# EasyEDA Pro project my_supercap_1.eprj, schematic 下板

## Sheets
1 系统总览与接口: Board Name: Board1; Create Date: 2026-09-18; Page Name: 系统总览与接口; Project Name: my_supercap_1; Schematic Name: Schematic1; Update Date: 2026-09-18; Company: 嘉立创EDA; Page Size: A4; Version: V1.0
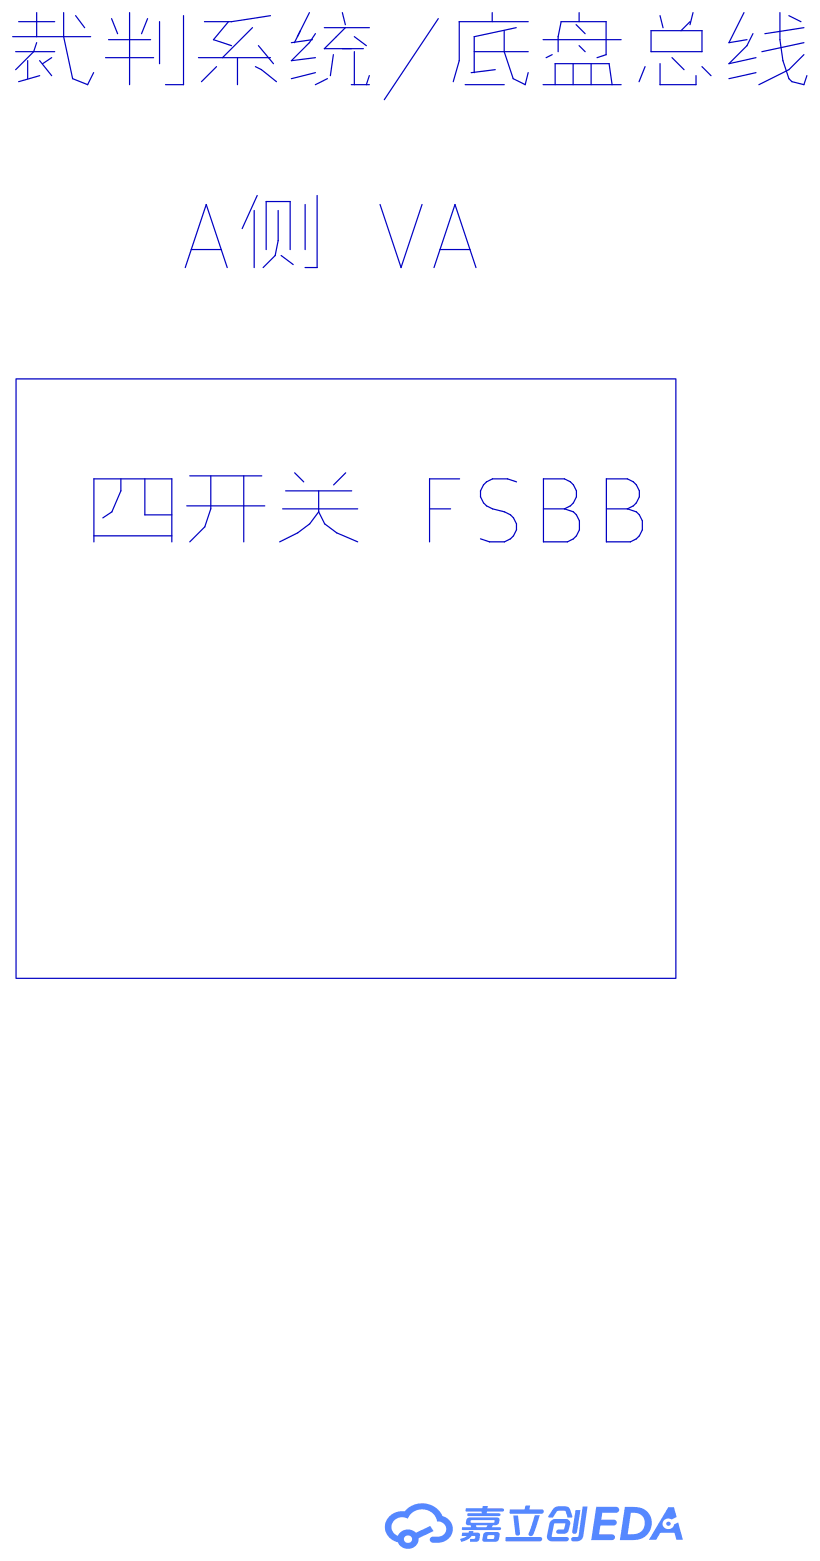
[diagram p0: 系统总览与接口]
2 功率板_四开关主功率回路: Board Name: 下板; Page Name: 功率板_四开关主功率回路; Schematic Name: 下板; Update Date: 2026-09-19
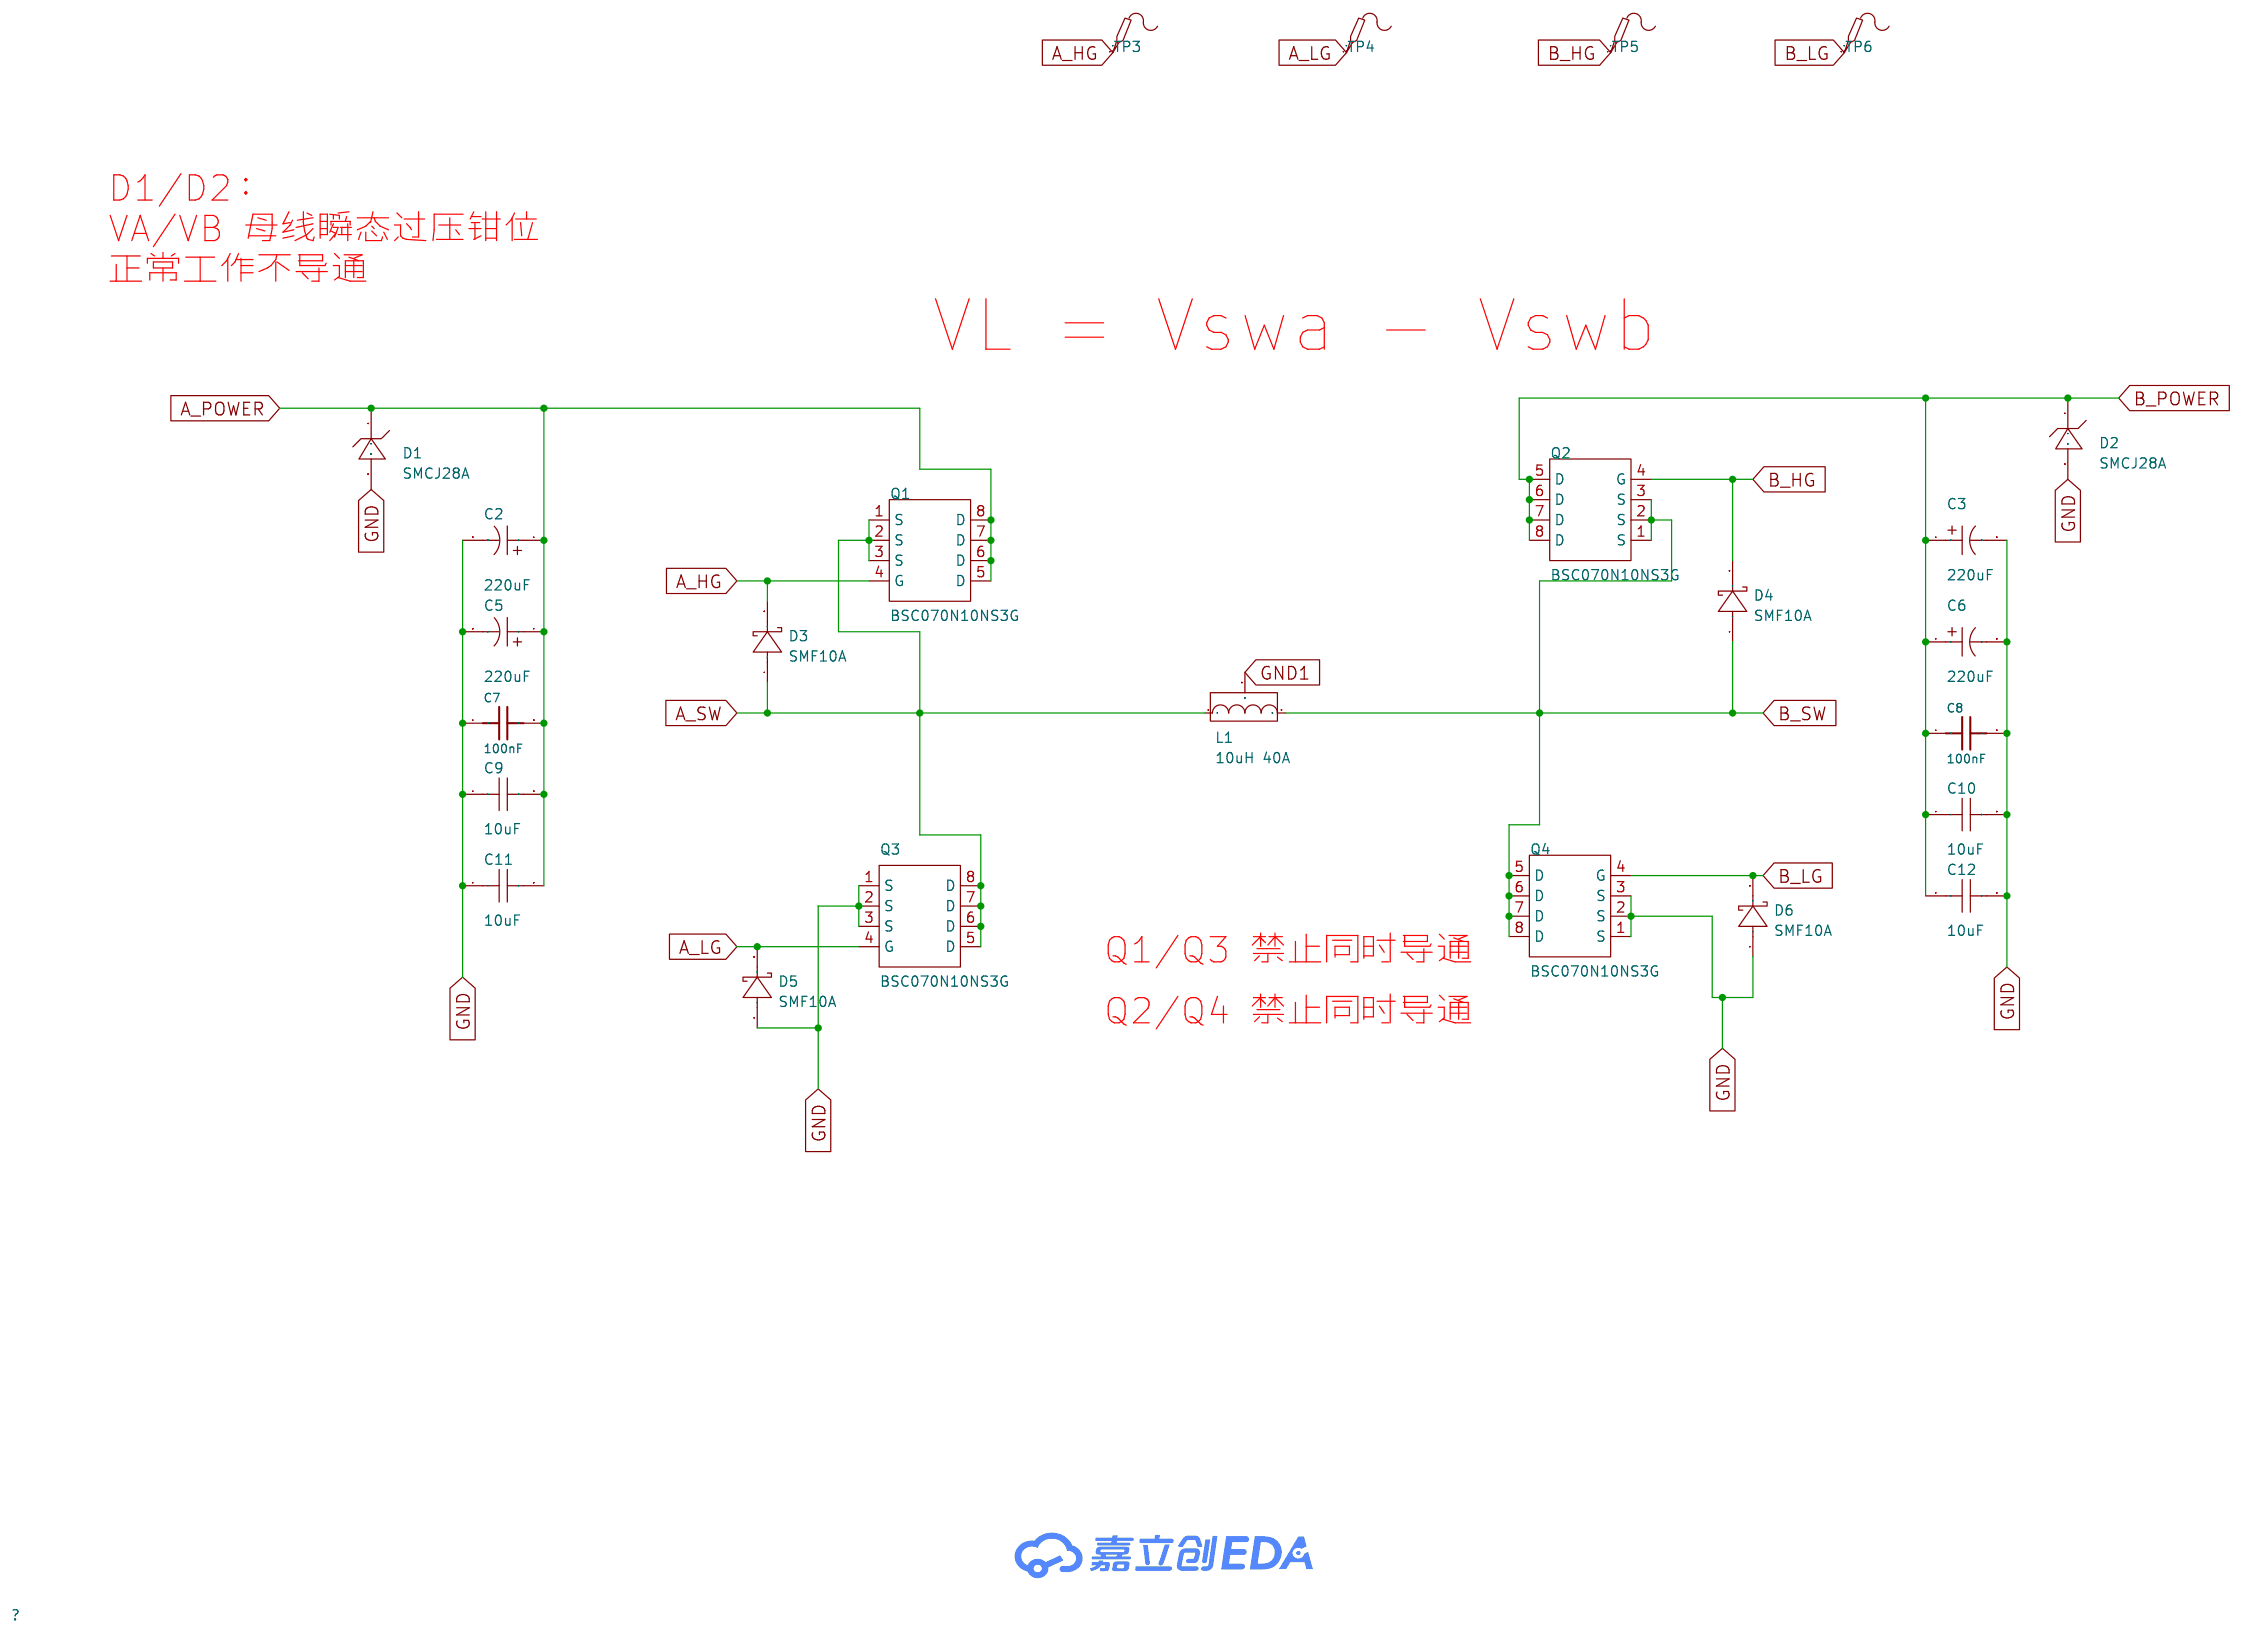
[diagram p1: 功率板_四开关主功率回路]
3 功率板_A/B侧栅极驱动: Board Name: 下板; Page Name: 功率板_A/B侧栅极驱动; Schematic Name: 下板
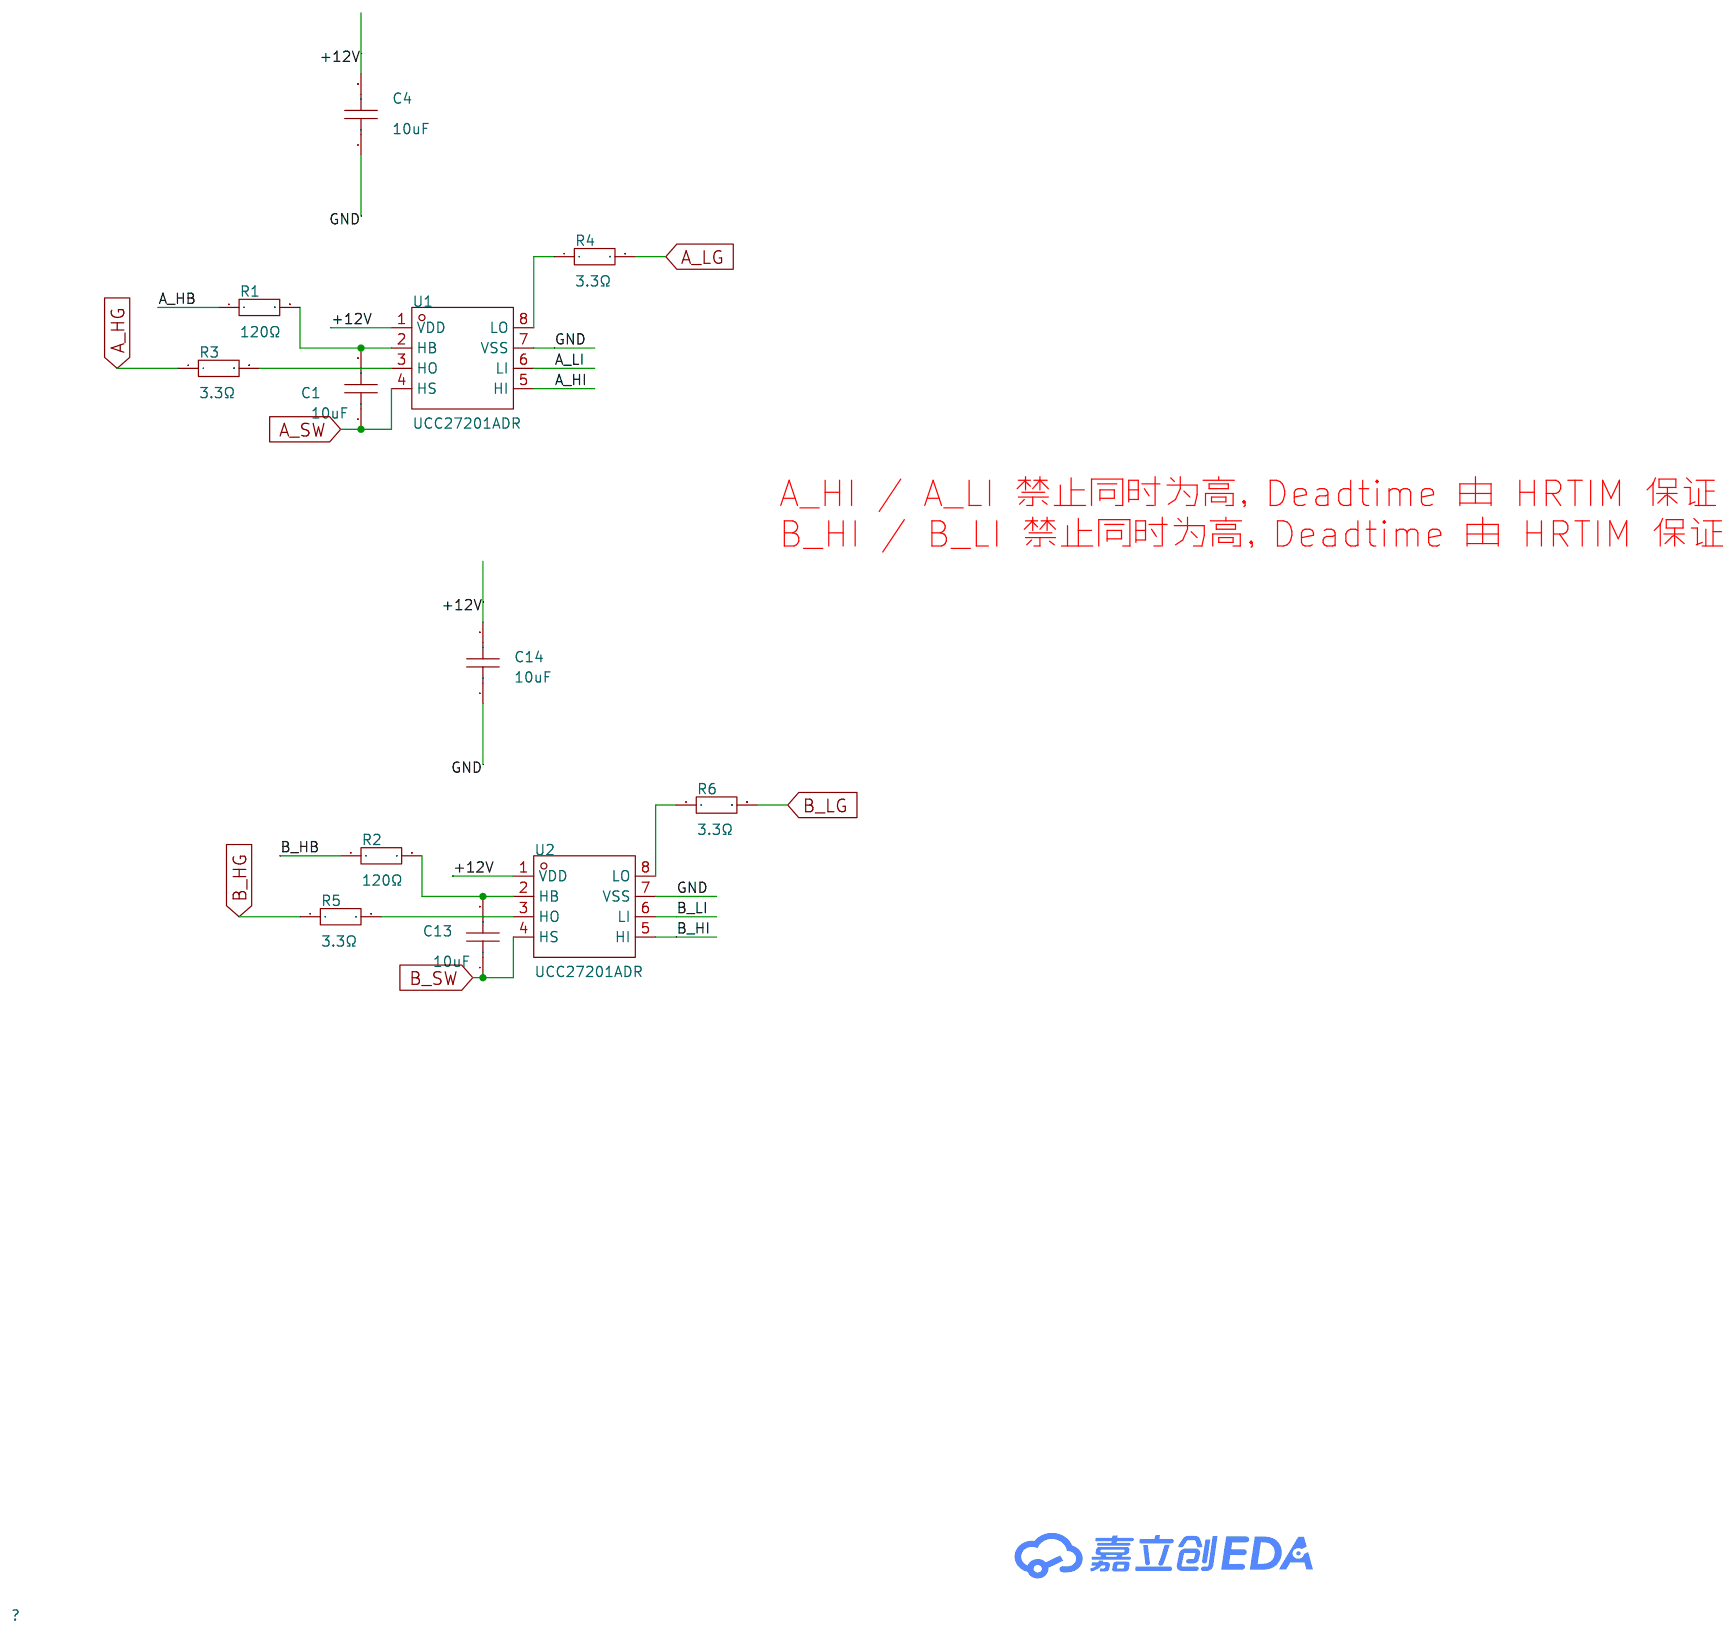
[diagram p2: 功率板_A/B侧栅极驱动]
4 上下板连接与调试测试点: Board Name: 下板; Page Name: 上下板连接与调试测试点; Schematic Name: 下板
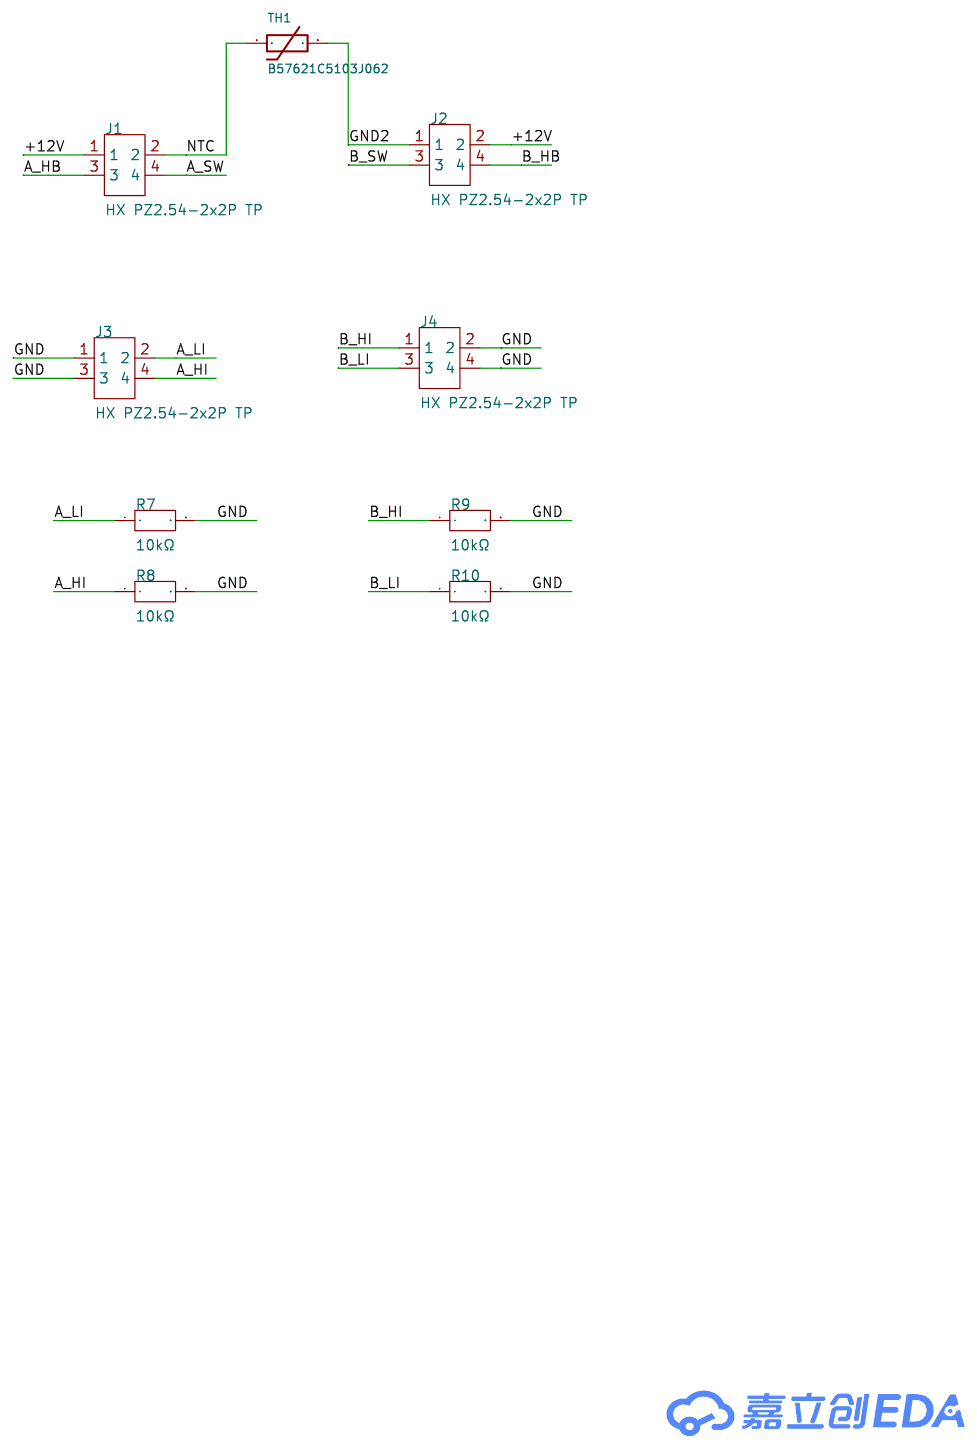
[diagram p3: 上下板连接与调试测试点]

## Parts
sheet 上下板连接与调试测试点
J1  HX PZ2.54-2x2P TP  [HDR-SMD_4P-P2.54-V-M-R2-C2-LS7.5]
J2  HX PZ2.54-2x2P TP  [HDR-SMD_4P-P2.54-V-M-R2-C2-LS7.5]
J3  HX PZ2.54-2x2P TP  [HDR-SMD_4P-P2.54-V-M-R2-C2-LS7.5]
J4  HX PZ2.54-2x2P TP  [HDR-SMD_4P-P2.54-V-M-R2-C2-LS7.5]
R7  10kΩ  [R0603]
R8  10kΩ  [R0603]
R9  10kΩ  [R0603]
R10  10kΩ  [R0603]
TH1  B57621C5103J062  [R1206]
sheet 功率板_A/B侧栅极驱动
C1  10uF  [C0603]
C4  10uF  [C1206]
C13  10uF  [C0603]
C14  10uF  [C1206]
R1  120Ω  [R1206]
R2  120Ω  [R1206]
R3  3.3Ω  [R0603]
R4  3.3Ω  [R0603]
R5  3.3Ω  [R0603]
R6  3.3Ω  [R0603]
U1  UCC27201ADR  [SOIC-8_L4.9-W3.9-P1.27-LS6.0-BL]
U2  UCC27201ADR  [SOIC-8_L4.9-W3.9-P1.27-LS6.0-BL]
sheet 功率板_四开关主功率回路
C2  220uF  [CAP-SMD_BD8.0-L8.3-W8.3-LS9.0-FD]
C3  220uF  [CAP-SMD_BD8.0-L8.3-W8.3-LS9.0-FD]
C5  220uF  [CAP-SMD_BD8.0-L8.3-W8.3-LS9.0-FD]
C6  220uF  [CAP-SMD_BD8.0-L8.3-W8.3-LS9.0-FD]
C7  100nF  [C0603]
C8  100nF  [C0603]
C9  10uF  [C1206]
C10  10uF  [C1206]
C11  10uF  [C1206]
C12  10uF  [C1206]
D1  SMCJ28A  [SMC_L6.9-W5.9-LS7.9-RD]
D2  SMCJ28A  [SMC_L6.9-W5.9-LS7.9-RD]
D3  SMF10A  [SOD-123FL_L3.0-W1.8-LS3.7-R-RD]
D4  SMF10A  [SOD-123FL_L3.0-W1.8-LS3.7-R-RD]
D5  SMF10A  [SOD-123FL_L3.0-W1.8-LS3.7-R-RD]
D6  SMF10A  [SOD-123FL_L3.0-W1.8-LS3.7-R-RD]
L1  10uH 40A  [IND-SMD_3P-L27.9-W19.7-P10.43-LS27.9-BL-A]
Q1  BSC070N10NS3G  [PG-TDSON-8_L5.0-W6.0-P1.27-BL-EP]
Q2  BSC070N10NS3G  [PG-TDSON-8_L5.0-W6.0-P1.27-BL-EP]
Q3  BSC070N10NS3G  [PG-TDSON-8_L5.0-W6.0-P1.27-BL-EP]
Q4  BSC070N10NS3G  [PG-TDSON-8_L5.0-W6.0-P1.27-BL-EP]
TP3  -  [Test-Point-0.5mm]
TP4  -  [Test-Point-0.5mm]
TP5  -  [Test-Point-0.5mm]
TP6  -  [Test-Point-0.5mm]

## Library data of the parts
J1-J4 = HX PZ2.54-2x2P TP: LCSC Part Name: 2x2P 间距:2.54mm 方针 立贴; Supplier Part: C32713282; Manufacturer: hanxia(韩下); Supplier Footprint: SMD,P=2.54mm; Datasheet: https://item.szlcsc.com/datasheet/HX%2520PZ2.54-2x2P%2520TP/34444562.html; Supplier: LCSC; Pin Structure: 2x2P; Pitch: 2.54mm; Row Spacing: 2.54mm; Circluar Pins/Square Pins: 方针; Mounting Type: 立贴; Number of Rows: 双排; Number of Pins: 4P; Current Rating: 3A; Voltage Rating (Max): 1kV; Length of Mating Pin: 6mm; Insulation Height: 2.5mm; Contact Material: 黄铜; Contact Plating: 金; Operating Temperature: -40℃~+105℃; Color: 黑色
R7-R10 = FRC0603F1002TS: LCSC Part Name: 10kΩ ±1% 100mW 厚膜电阻; Supplier Part: C2906982; Manufacturer: FOJAN(富捷); Supplier Footprint: 0603; JLCPCB Part Class: 扩展库; Datasheet: https://item.szlcsc.com/datasheet/FRC0603F1002TS/3180495.html; Supplier: LCSC; Type: 厚膜电阻; Tolerance: ±1%; Power(Watts): 100mW; Voltage-Supply(Max): 75V; Temperature Coefficient: ±100ppm/℃; Operating Temperature: -55℃~+155℃
TH1 = B57621C5103J062: LCSC Part Name: 10kΩ 3470K 300mW; Supplier Part: C3152964; Manufacturer: TDK; Supplier Footprint: 1206; Datasheet: https://item.szlcsc.com/datasheet/B57621C5103J062/3714900.html; Supplier: LCSC; Power(Watts): 300mW; Resistance @ 25℃: 10kΩ; Resistance Tolerance: ±5%; B Constant Tolerance: ±3%; B Constant (25℃/50℃): 3470K; B Constant (25℃/85℃): 3510K; B Constant (25℃/100℃): 3530K; Dissipation Factor: 5mW/℃; Thermal Time Constant: 10s; Operating Temperature: -55℃~+125℃; Length: 3.2mm; Width: 1.6mm
C1 C13 = CL10A106MA8NRNC: LCSC Part Name: 10uF ±20% 25V; Supplier Part: C96446; Manufacturer: SAMSUNG(三星); Supplier Footprint: 0603; JLCPCB Part Class: 基础库; Datasheet: https://item.szlcsc.com/datasheet/CL10A106MA8NRNC/97651.html; Supplier: LCSC; Tolerance: ±20%; Voltage Rating: 25V; Temperature Coefficient: X5R
C4 C9-C12 C14 = CGA5L1X7R1H106KT0Y0N: LCSC Part Name: 10uF ±10% 50V; Supplier Part: C531431; Manufacturer: TDK; Supplier Footprint: 1206; JLCPCB Part Class: 扩展库; Datasheet: https://item.szlcsc.com/datasheet/CGA5L1X7R1H106KT0Y0N/551592.html; Supplier: LCSC; Tolerance: ±10%; Voltage Rating: 50V; Temperature Coefficient: X7R
R1 R2 = 1206W4F1200T5E: LCSC Part Name: 厚膜电阻 120Ω ±1%; Supplier Part: C17909; Manufacturer: UNI-ROYAL(厚声); Supplier Footprint: 1206; JLCPCB Part Class: 基础库; Datasheet: https://item.szlcsc.com/datasheet/1206W4F1200T5E/18597.html; Supplier: LCSC; Type: 厚膜电阻; Tolerance: ±1%; Power(Watts): 250mW; Voltage-Supply(Max): 200V; Temperature Coefficient: ±100ppm/℃; Operating Temperature: -55℃~+155℃
R3-R6 = 0603WAF330KT5E: LCSC Part Name: 厚膜电阻 3.3Ω ±1%; Supplier Part: C22979; Manufacturer: UNI-ROYAL(厚声); Supplier Footprint: 0603; JLCPCB Part Class: 扩展库; Datasheet: https://item.szlcsc.com/datasheet/0603WAF330KT5E/23706.html; Supplier: LCSC; Type: 厚膜电阻; Tolerance: ±1%; Power(Watts): 100mW; Voltage-Supply(Max): 75V; Temperature Coefficient: ±200ppm/℃; Operating Temperature: -55℃~+155℃
U1 U2 = UCC27201ADR: LCSC Part Name: 120V升压3A峰值电流的高频高侧和低侧驱动器; Supplier Part: C913823; Manufacturer: TI(德州仪器); Supplier Footprint: SOIC-8; Datasheet: https://www.ti.com/cn/lit/ds/symlink/ucc27201a.pdf; Supplier: LCSC; Driven Configuration: 半桥; Load Type: MOSFET; Number of Drivers: 2; Current - Output Low(IOL): 3A; Current - Output High(IOH): 3A; Voltage - Supply: 8V~17V; Rise Time: 8ns; Fall Time: 7ns; Propagation Delay tpLH: 20ns; Propagation Delay tpHL: 20ns; Operating Temperature: -40℃~+140℃; Input Logic Level - High: 1.7V~2.5V; Input Logic Level - Low: 800mV~1.6V; Quiescent Current(Iq): 800uA; Features: 内置自举二极管
C2 C3 C5 C6 = MA35V220M8X9: LCSC Part Name: 220uF ±20% 35V; Supplier Part: C46550469; Manufacturer: JIERR(捷而瑞); Supplier Footprint: SMD,D8xL9mm; JLCPCB Part Class: 扩展库; Datasheet: https://item.szlcsc.com/datasheet/MA35V220M8X9/48680163.html; Supplier: LCSC; Tolerance: ±20%; Voltage Rating: 35V; Ripple Current: 2.9A@100kHz; Equivalent Series Resistance(ESR): 28mΩ@100kHz; Type: 聚合物; Diameter: 8mm; Height - Seated (Max): 9mm; Lifetime: 2000hrs@105℃; Operating Temperature: -55℃~+105℃; Polarity type: 有极性
C7 C8 = CGA3E2X7R1H104KT0Y0N: LCSC Part Name: 100nF ±10% 50V; Supplier Part: C76711; Manufacturer: TDK; Supplier Footprint: 0603; JLCPCB Part Class: 扩展库; Datasheet: https://item.szlcsc.com/datasheet/CGA3E2X7R1H104KT0Y0N/77838.html; Supplier: LCSC; Tolerance: ±10%; Voltage Rating: 50V; Temperature Coefficient: X7R
D1 D2 = SMCJ28A_C224047: LCSC Part Name: 单向TVS 28V截止 峰值脉冲电流：33.1A; Supplier Part: C224047; Manufacturer: Littelfuse(美国力特); Supplier Footprint: DO-214AB; Datasheet: https://item.szlcsc.com/datasheet/SMCJ28A/224195.html; Supplier: LCSC; Polarity: 单向; Reverse Stand-Off Voltage (Vrwm): 28V; Clamping Voltage: 45.4V; Peak Pulse Current (Ipp): 33.1A; Peak Pulse Power Dissipation (Ppp): 1.5kW@10/1000us; Voltage - Breakdown: 34.4V; Reverse Leakage Current (Ir): 1uA; Number of Channels: 单路; Operating Temperature: -65℃~+150℃; level of protection: IEC 61000-4-4；IEC 61000-4-2; Type: TVS
D3-D6 = SMF10A_C726899: LCSC Part Name: 单向TVS 10V截止 峰值浪涌电流：11.8A@10/1000us; Supplier Part: C726899; Manufacturer: TWGMC(迪嘉); Supplier Footprint: SOD-123FL; JLCPCB Part Class: 扩展库; Datasheet: https://item.szlcsc.com/datasheet/SMF10A/774004.html; Supplier: LCSC; Polarity: 单向; Reverse Stand-Off Voltage (Vrwm): 10V; Clamping Voltage: 17V; Peak Pulse Current (Ipp): 11.8A@10/1000us; Peak Pulse Power Dissipation (Ppp): 200W@10/1000us; Voltage - Breakdown: 12.3V; Reverse Leakage Current (Ir): 2.5uA; Number of Channels: 单路; Operating Temperature: -55℃~+150℃; Type: TVS
L1 = RSPQ2918-100M: LCSC Part Name: 扁线大电流电感; Supplier Part: C32712982; Manufacturer: Ruishen(瑞申电子); Supplier Footprint: SMD-3P,27.9x22.7mm; Datasheet: https://item.szlcsc.com/datasheet/RSPQ2918-100M/34443175.html; Supplier: LCSC; Tolerance: ±20%; Current Rating: 28A; Current - Saturation(Isat): 32.1A; DC Resistance(DCR): 2.6mΩ; Type: 扁线绕线电感
Q1-Q4 = BSC070N10NS3G: LCSC Part Name: 1个N沟道 耐压:100V 电流:90A; Supplier Part: C501502; Manufacturer: Infineon(英飞凌); Supplier Footprint: TDSON-8(5x6); JLCPCB Part Class: 扩展库; Datasheet: https://item.szlcsc.com/datasheet/BSC070N10NS3G/513940.html; Supplier: LCSC; Number: 1个N沟道; Drain to Source Voltage: 100V; Current - Continuous Drain(Id): 90A; RDS(on): 7mΩ@10V; Pd - Power Dissipation: 114W; Gate Threshold Voltage (Vgs(th)): 3.5V; Gate Charge(Qg): 42nC@10V; Input Capacitance(Ciss): 3nF; Reverse Transfer Capacitance (Crss@Vds): 21pF; Operating Temperature: -55℃~+150℃; Type: N沟道; Output Capacitance(Coss): 520pF; Vgs: ±20V
TP3-TP6 = Test-Point

## Nets
+12V: C4.2 C14.2 J1.1 J2.2 U1.1(VDD) U2.1(VDD)
GND: C2.2 C3.2 C4.1 C5.2 C6.2 C7.1 C8.2 C9.1 C10.2 C11.1 C12.2 C14.1 D1.2 D2.2 D5.1(A) D6.1(A) J3.1 J3.3 J4.2 J4.4 Q3.1(S) Q3.2(S) Q3.3(S) Q4.1(S) Q4.2(S) Q4.3(S) R7.2 R8.2 R9.2 R10.2 U1.7(VSS) U2.7(VSS)
GND1: L1.3(NC)
GND2: J2.1 TH1.2
A_HB: J1.3 R1.1
A_HG: D3.2(K) Q1.4(G) R3.1 TP3.1
A_HI: J3.4 R8.1 U1.5(HI)
A_LG: D5.2(K) Q3.4(G) R4.2 TP4.1
A_LI: J3.2 R7.1 U1.6(LI)
A_POWER: C2.1 C5.1 C7.2 C9.2 C11.2 D1.1 Q1.5(D) Q1.6(D) Q1.7(D) Q1.8(D)
A_SW: C1.1 D3.1(A) J1.4 L1.1 Q1.1(S) Q1.2(S) Q1.3(S) Q3.5(D) Q3.6(D) Q3.7(D) Q3.8(D) U1.4(HS)
B_HB: J2.4 R2.1
B_HG: D4.2(K) Q2.4(G) R5.1 TP5.1
B_HI: J4.1 R9.1 U2.5(HI)
B_LG: D6.2(K) Q4.4(G) R6.2 TP6.1
B_LI: J4.3 R10.1 U2.6(LI)
B_POWER: C3.1 C6.1 C8.1 C10.1 C12.1 D2.1 Q2.5(D) Q2.6(D) Q2.7(D) Q2.8(D)
B_SW: C13.1 D4.1(A) J2.3 L1.2 Q2.1(S) Q2.2(S) Q2.3(S) Q4.5(D) Q4.6(D) Q4.7(D) Q4.8(D) U2.4(HS)
NTC: J1.2 TH1.1
$3N434: R4.1 U1.8(LO)
$3N504: R3.2 U1.3(HO)
$3N611: C1.2 R1.2 U1.2(HB)
$3N1021: R6.1 U2.8(LO)
$3N1030: R5.2 U2.3(HO)
$3N1032: C13.2 R2.2 U2.2(HB)

## Notes on the sheets
sheet 1
- 裁判系统/底盘总线
- A侧 VA
- 四开关 FSBB
sheet 2
- D1/D2：
  VA/VB 母线瞬态过压钳位
  正常工作不导通
- VL = Vswa - Vswb
- Q1/Q3 禁止同时导通
- Q2/Q4 禁止同时导通
sheet 3
- A_HI / A_LI 禁止同时为高，Deadtime 由 HRTIM 保证
  B_HI / B_LI 禁止同时为高，Deadtime 由 HRTIM 保证
